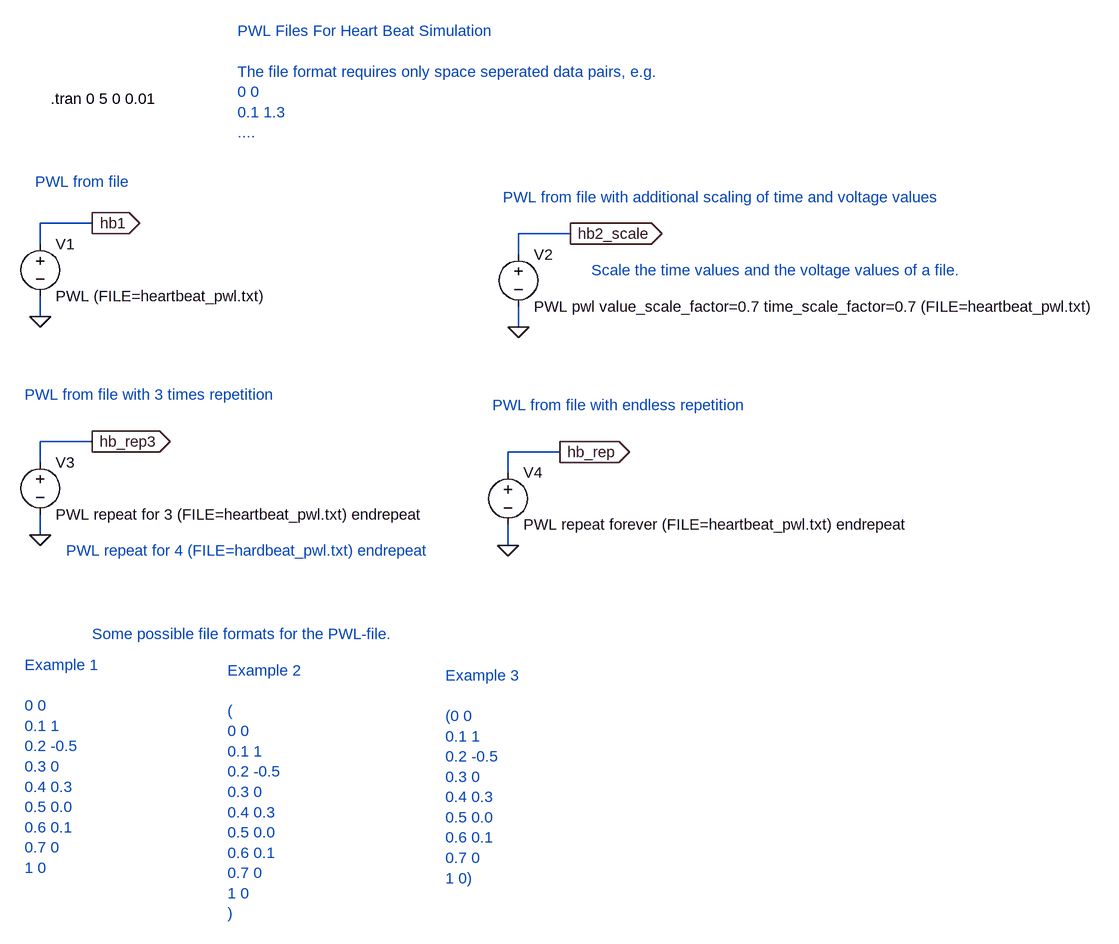
[diagram p0: schematic heartbeat.asc]
heartbeat.asc, the LTspice schematic file:
Version 4
SHEET 1 1896 960
WIRE 704 -528 704 -560
WIRE 704 -560 784 -560
WIRE 704 -448 704 -416
WIRE -32 -544 -32 -576
WIRE -32 -576 48 -576
WIRE -32 -464 -32 -432
WIRE -32 -208 -32 -240
WIRE -32 -240 48 -240
WIRE -32 -128 -32 -96
WIRE 688 -192 688 -224
WIRE 688 -224 768 -224
WIRE 688 -112 688 -80
FLAG 704 -416 0
FLAG 784 -560 hb2_scale
IOPIN 784 -560 Out
FLAG -32 -432 0
FLAG 48 -576 hb1
IOPIN 48 -576 Out
FLAG -32 -96 0
FLAG 48 -240 hb_rep3
IOPIN 48 -240 Out
FLAG 688 -80 0
FLAG 768 -224 hb_rep
IOPIN 768 -224 Out
SYMBOL voltage 704 -544 R0
WINDOW 123 0 0 Left 0
WINDOW 39 0 0 Left 0
SYMATTR InstName V2
SYMATTR Value PWL pwl value_scale_factor=0.7 time_scale_factor=0.7 (FILE=heartbeat_pwl.txt)
SYMBOL voltage -32 -560 R0
WINDOW 123 0 0 Left 0
WINDOW 39 0 0 Left 0
SYMATTR InstName V1
SYMATTR Value PWL (FILE=heartbeat_pwl.txt)
SYMBOL voltage -32 -224 R0
WINDOW 123 0 0 Left 0
WINDOW 39 0 0 Left 0
SYMATTR InstName V3
SYMATTR Value PWL repeat for 3 (FILE=heartbeat_pwl.txt) endrepeat
SYMBOL voltage 688 -208 R0
WINDOW 123 0 0 Left 0
WINDOW 39 0 0 Left 0
SYMATTR InstName V4
SYMATTR Value PWL repeat forever (FILE=heartbeat_pwl.txt) endrepeat
TEXT -16 -768 Left 0 !.tran 0 5 0 0.01
TEXT 680 -616 Left 0 ;PWL from file with additional scaling of time and voltage values
TEXT 816 -504 Left 0 ;Scale the time values and the voltage values of a file.
TEXT -40 -640 Left 0 ;PWL from file
TEXT -56 104 Left 0 ;Example 1\n    \n0 0\n0.1 1  \n0.2 -0.5\n0.3 0\n0.4 0.3\n0.5 0.0\n0.6 0.1\n0.7 0\n1 0
TEXT 256 112 Left 0 ;Example 2\n \n(    \n0 0\n0.1 1  \n0.2 -0.5\n0.3 0\n0.4 0.3\n0.5 0.0\n0.6 0.1\n0.7 0\n1 0\n)
TEXT 592 120 Left 0 ;Example 3\n    \n(0 0\n0.1 1  \n0.2 -0.5\n0.3 0\n0.4 0.3\n0.5 0.0\n0.6 0.1\n0.7 0\n1 0)
TEXT 48 56 Left 0 ;Some possible file formats for the PWL-file.
TEXT -56 -312 Left 0 ;PWL from file with 3 times repetition
TEXT 8 -72 Left 0 ;PWL repeat for 4 (FILE=hardbeat_pwl.txt) endrepeat
TEXT 664 -296 Left 0 ;PWL from file with endless repetition
TEXT 272 -872 Left 0 ;PWL Files For Heart Beat Simulation\n \nThe file format requires only space seperated data pairs, e.g. \n0 0\n0.1 1.3\n....

The netlist it stands for:
* heartbeat.asc
V2 hb2_scale 0 PWL pwl value_scale_factor=0.7 time_scale_factor=0.7 (FILE=heartbeat_pwl.txt)
V1 hb1 0 PWL (FILE=heartbeat_pwl.txt)
V3 hb_rep3 0 PWL repeat for 3 (FILE=heartbeat_pwl.txt) endrepeat
V4 hb_rep 0 PWL repeat forever (FILE=heartbeat_pwl.txt) endrepeat
.tran 0 5 0 0.01
* PWL from file with additional scaling of time and voltage values
* Scale the time values and the voltage values of a file.
* PWL from file
* Example 1
* 0 0
* 0.1 1
* 0.2 -0.5
* 0.3 0
* 0.4 0.3
* 0.5 0.0
* 0.6 0.1
* 0.7 0
* 1 0
* Example 2
* (
* 0 0
* 0.1 1
* 0.2 -0.5
* 0.3 0
* 0.4 0.3
* 0.5 0.0
* 0.6 0.1
* 0.7 0
* 1 0
* )
* Example 3
* (0 0
* 0.1 1
* 0.2 -0.5
* 0.3 0
* 0.4 0.3
* 0.5 0.0
* 0.6 0.1
* 0.7 0
* 1 0)
* Some possible file formats for the PWL-file.
* PWL from file with 3 times repetition
* PWL repeat for 4 (FILE=hardbeat_pwl.txt) endrepeat
* PWL from file with endless repetition
* PWL Files For Heart Beat Simulation
* The file format requires only space seperated data pairs, e.g.
* 0 0
* 0.1 1.3
* ....
.backanno
.end